# EAGLE design ARE_adaptadora_Propeller_40pin (EAGLE 6.5.0)
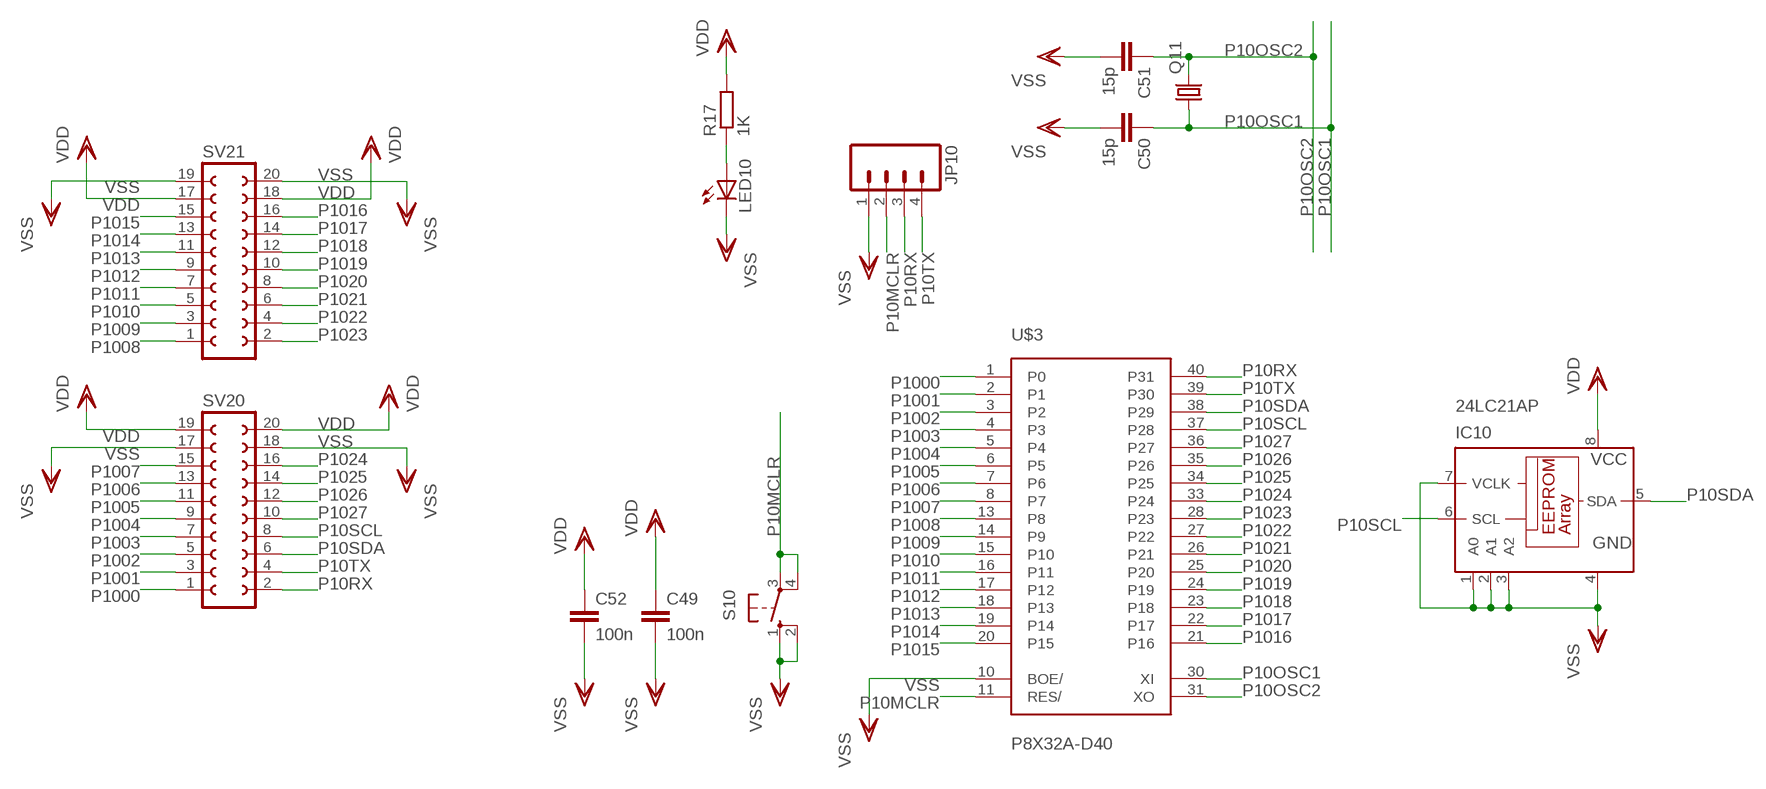
[diagram p0: schematic, sheet 1]

## Parts
C49  100n  C-EUC0805  [C0805]
C50  15p  C-EUC0805  [C0805]
C51  15p  C-EUC0805  [C0805]
C52  100n  C-EUC0805  [C0805]
IC10  24LC21AP  [DIL8]
JP10  M04PTH  [1X04]
LED10  LED3MM  [LED3MM]
Q11  CRYSTALHC18U-V  [HC18U-V]
R17  1K  R-EU_R0805  [R0805]
S10  10-XX  [B3F-10XX]
SV20  FE10-2W  [FE10-2W]
SV21  FE10-2W  [FE10-2W]
U$3  P8X32A-D40  [P8X32A-D40]

## Nets
N$13: LED10.A R17.1
P10MCLR: JP10.2 S10.3(P) S10.4(P1) U$3.11(RES/)
P10OSC1: C50.1 Q11.1 U$3.30(XI)
P10OSC2: C51.1 Q11.2 U$3.31(XO)
P10RX: JP10.3 SV20.2 U$3.40(P31)
P10SCL: IC10.6(SCL) SV20.8 U$3.37(P28)
P10SDA: IC10.5(SDA) SV20.6 U$3.38(P29)
P10TX: JP10.4 SV20.4 U$3.39(P30)
P1000: SV20.1 U$3.1(P0)
P1001: SV20.3 U$3.2(P1)
P1002: SV20.5 U$3.3(P2)
P1003: SV20.7 U$3.4(P3)
P1004: SV20.9 U$3.5(P4)
P1005: SV20.11 U$3.6(P5)
P1006: SV20.13 U$3.7(P6)
P1007: SV20.15 U$3.8(P7)
P1008: SV21.1 U$3.13(P8)
P1009: SV21.3 U$3.14(P9)
P1010: SV21.5 U$3.15(P10)
P1011: SV21.7 U$3.16(P11)
P1012: SV21.9 U$3.17(P12)
P1013: SV21.11 U$3.18(P13)
P1014: SV21.13 U$3.19(P14)
P1015: SV21.15 U$3.20(P15)
P1016: SV21.16 U$3.21(P16)
P1017: SV21.14 U$3.22(P17)
P1018: SV21.12 U$3.23(P18)
P1019: SV21.10 U$3.24(P19)
P1020: SV21.8 U$3.25(P20)
P1021: SV21.6 U$3.26(P21)
P1022: SV21.4 U$3.27(P22)
P1023: SV21.2 U$3.28(P23)
P1024: SV20.16 U$3.33(P24)
P1025: SV20.14 U$3.34(P25)
P1026: SV20.12 U$3.35(P26)
P1027: SV20.10 U$3.36(P27)
VDD: C49.1 C52.1 IC10.8(VCC) R17.2 SV20.19 SV20.20 SV21.17 SV21.18
VSS: C49.2 C50.2 C51.2 C52.2 IC10.1(A0) IC10.2(A1) IC10.3(A2) IC10.4(GND) IC10.7(VCLK) JP10.1 LED10.K(C) S10.1(S) S10.2(S1) SV20.17 SV20.18 SV21.19 SV21.20 U$3.10(BOE/)

## Power pins joined to a net without a drawn wire
VDD: U$3.12(VDD) U$3.32(VDD)
VSS: U$3.9(VSS) U$3.29(VSS)

## Library data of the parts
C49-C52 = rcl:C-EU: CAPACITOR, European symbol
IC10 = microchip_nuevo:24L*: Serial EEPROM 128 byte/1 K
JP10 = SparkFun:M04: Header 4 Standard 4-pin 0.1" header. Use with straight break away headers (SKU : PRT-00116), right angle break away headers (PRT-00553), swiss pins (PRT-00743), machine pins (PRT-00117), and female headers (PRT-00115). Molex polarized connector foot print use with SKU : PRT-08231 with associated crimp pins and housings. 1MM SMD Version SKU: PRT-10208
LED10 = SparkFun:LED: LEDs Standard schematic elements and footprints for 5mm, 3mm, 1206, and 0603 sized LEDs. 5mm - Spark Fun Electronics SKU : COM-00529 (and others)
Q11 = crystal:CRYSTAL: CRYSTAL; OC_FARNELL: unknown; OC_NEWARK: unknown
R17 = rcl:R-EU_: RESISTOR, European symbol
S10 = switch-omron:10-XX: OMRON SWITCH; MPN: B3F-1000; OC_FARNELL: 176432; OC_NEWARK: 36M3542
SV20 SV21 = con-lsta:FE10-2W: FEMALE HEADER; OC_FARNELL: unknown; OC_NEWARK: unknown
U$3 = parallax_propeller:P8X32A-D40

## Board
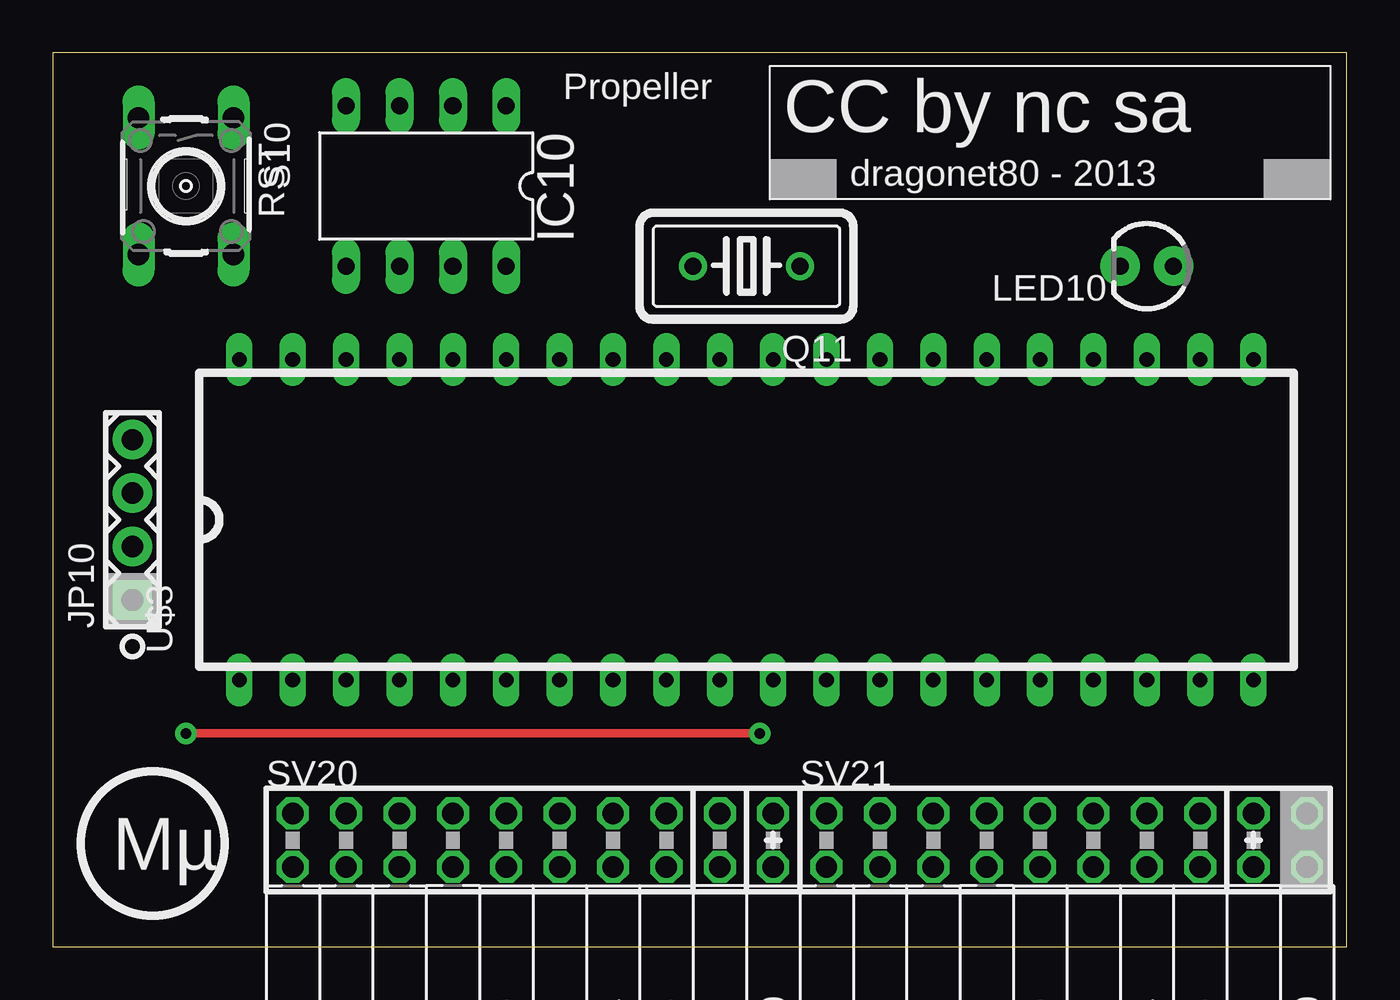
[diagram p1: board, top side]
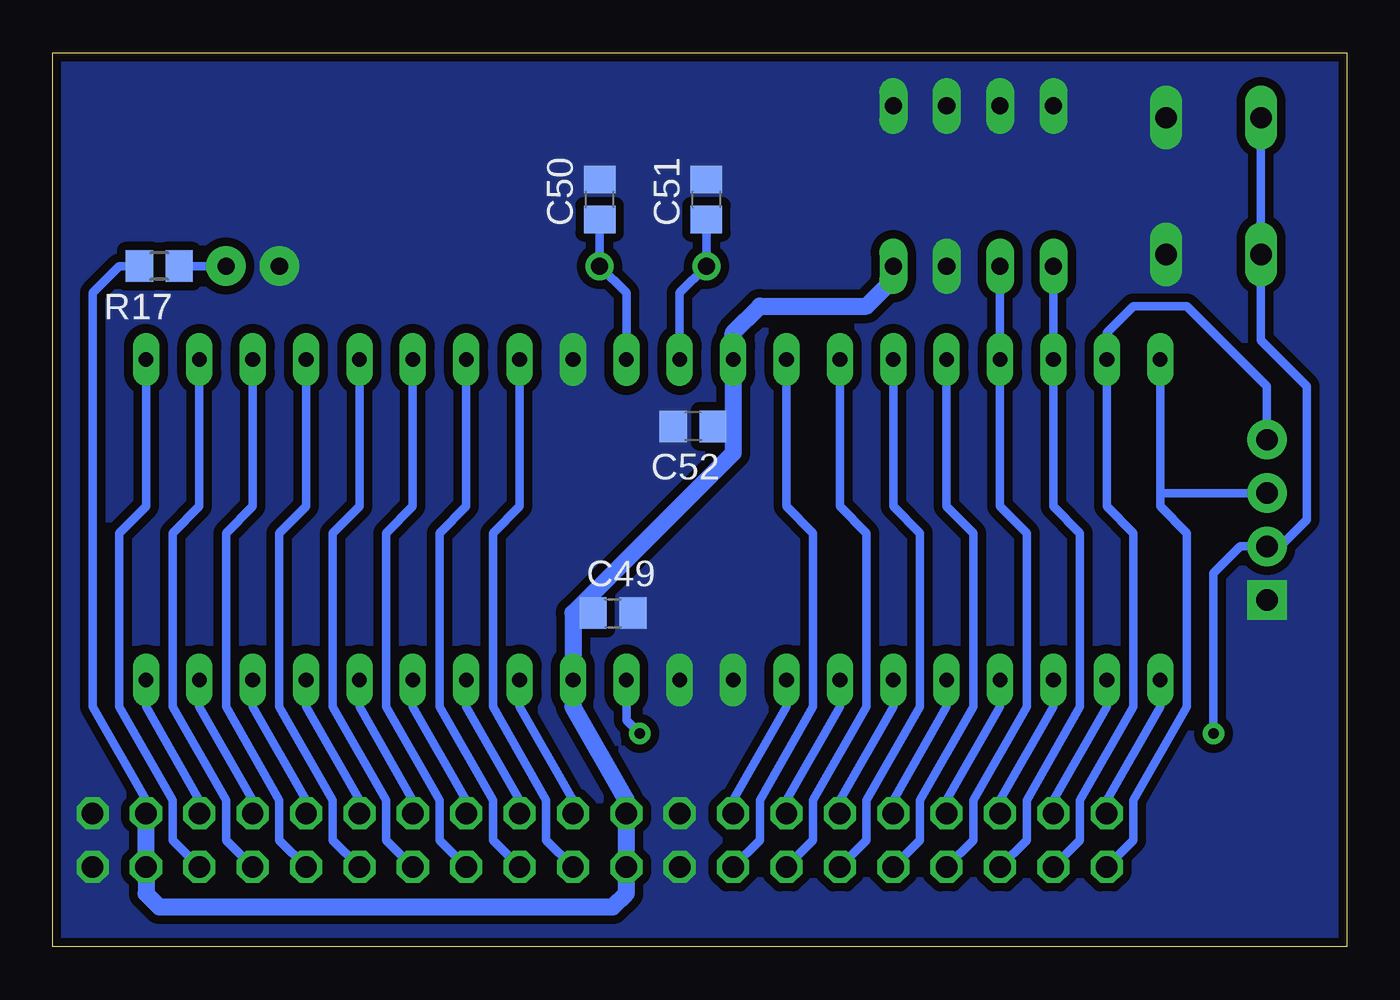
[diagram p2: board, bottom side, seen from below]

Size 61.59 x 42.55 mm. Coordinates in mm from the lower left corner, seen from the top.
Outline: 0,0 61.6,0 61.6,42.55 0,42.55 0,0
Copper layers (1*16): Top 0.035mm / dielectric 1.5mm / Bottom 0.035mm
Design rules "ITEADstudio_DRC": minimum track width 6mil, minimum drill 12mil, track to track 6mil, track to pad 6mil, pad to pad 6mil, via to via 6mil, smd to smd 0mil, copper to edge 10mil, drill to drill 10mil, minimum pad ring 10mil, minimum via ring 6mil, stop-mask expansion 2mil, vias tented up to drill 100mil, thermal gap 10mil

### Footprints (pad centres in the part's own frame; a part is rotated, then mirrored left to right if it is on the bottom)
C0805 = smd 1.3 x 1.5: 1 -0.95,0; 2 0.95,0
DIL8 = drill 0.813 long: 1 -3.81,-3.81; 2 -1.27,-3.81; 3 1.27,-3.81; 4 3.81,-3.81; 5 3.81,3.81; 6 1.27,3.81; 7 -1.27,3.81; 8 -3.81,3.81
1X04 = drill 1.016 pad 1.88 square: 1 0,0 | drill 1.016 pad 1.88: 2 2.54,0; 3 5.08,0; 4 7.62,0
LED3MM = drill 0.813 pad 1.88: A -1.27,0; K 1.27,0
HC18U-V = drill 0.813: 1 -2.54,0; 2 2.54,0
R0805 = smd 1.3 x 1.5: 1 -0.95,0; 2 0.95,0
B3F-10XX = drill 1.016 long: 1 -3.251,2.261; 2 3.251,2.261; 3 -3.251,-2.261; 4 3.251,-2.261
FE10-2W = drill 1.016 octagon: 1 -11.43,1.27; 2 -11.43,-1.27; 3 -8.89,1.27; 4 -8.89,-1.27; 5 -6.35,1.27; 6 -6.35,-1.27; 7 -3.81,1.27; 8 -3.81,-1.27; 9 -1.27,1.27; 10 -1.27,-1.27; 11 1.27,1.27; 12 1.27,-1.27; 13 3.81,1.27; 14 3.81,-1.27; 15 6.35,1.27; 16 6.35,-1.27; 17 8.89,1.27; 18 8.89,-1.27; 19 11.43,1.27; 20 11.43,-1.27
P8X32A-D40 = drill 0.7 pad 1.27 long: 1 -7.62,23.495; 2 -7.62,20.955; 3 -7.62,18.415; 4 -7.62,15.875; 5 -7.62,13.335; 6 -7.62,10.795; 7 -7.62,8.255; 8 -7.62,5.715; 9 -7.62,3.175; 10 -7.62,0.635; 11 -7.62,-1.905; 12 -7.62,-4.445; 13 -7.62,-6.985; 14 -7.62,-9.525; 15 -7.62,-12.065; 16 -7.62,-14.605; 17 -7.62,-17.145; 18 -7.62,-19.685; 19 -7.62,-22.225; 20 -7.62,-24.765; 21 7.62,-24.765; 22 7.62,-22.225; 23 7.62,-19.685; 24 7.62,-17.145; 25 7.62,-14.605; 26 7.62,-12.065; 27 7.62,-9.525; 28 7.62,-6.985; 29 7.62,-4.445; 30 7.62,-1.905; 31 7.62,0.635; 32 7.62,3.175; 33 7.62,5.715; 34 7.62,8.255; 35 7.62,10.795; 36 7.62,13.335; 37 7.62,15.875; 38 7.62,18.415; 39 7.62,20.955; 40 7.62,23.495

### Placement (x,y rotation side)
C49  34.92,15.88 0 bottom
C50  35.56,35.56 90 bottom
C51  30.48,35.56 90 bottom
C52  31.12,24.77 180 bottom
IC10  17.78,36.2 180 top
JP10  3.81,16.51 90 top
LED10  52.07,32.39 180 top
Q11  33.02,32.39 180 top
R17  56.52,32.39 180 bottom
S10  6.35,36.2 270 top
SV20  22.86,5.08 0 top
SV21  48.26,5.08 0 top
U$3  32.38,20.32 90 top

### Tracks (layer width: path | path; a pad name or v marks a point on that pad's centre or on a via)
N$13
  Bottom 0.406: R17.1 LED10.A
P10MCLR  (via drill 0.5 pad 1.02)
  Top 0.406: v33.66,10.16 v6.35,10.16
  Bottom 0.406: S10.3 S10.4 4.09,28.85 1.91,26.67 1.91,20.32 3.18,19.05 JP10.2 5.08,19.05 6.35,17.78 v6.35,10.16 | U$3.11 34.29,10.8 v33.66,10.16
P10OSC1
  Bottom 0.406: U$3.30 34.29,31.12 Q11.1 C50.1
P10OSC2
  Bottom 0.406: U$3.31 31.75,31.12 Q11.2 C51.1
P10RX
  Bottom 0.406: U$3.40 8.89,21.59 | 8.89,21.59 8.89,20.96 7.62,19.69 7.62,11.43 10.16,6.98 10.16,5.08 SV20.2 | JP10.3 8.89,21.59
P10SCL
  Bottom 0.406: SV20.8 17.78,5.08 17.78,6.98 15.24,11.43 15.24,19.69 16.51,20.96 U$3.37 IC10.6
P10SDA
  Bottom 0.406: SV20.6 15.24,5.08 15.24,6.98 12.7,11.43 12.7,19.69 13.97,20.96 U$3.38 IC10.5
P10TX
  Bottom 0.406: SV20.4 12.7,5.08 12.7,6.98 10.16,11.43 10.16,19.69 11.43,20.96 U$3.39 11.43,29.21 10.16,30.48 7.62,30.48 3.81,26.67 JP10.4
P1000
  Bottom 0.406: U$3.1 8.89,11.43 11.43,6.98 SV20.1
P1001
  Bottom 0.406: U$3.2 11.43,11.43 13.97,6.98 SV20.3
P1002
  Bottom 0.406: U$3.3 13.97,11.43 16.51,6.98 SV20.5
P1003
  Bottom 0.406: U$3.4 16.51,11.43 19.05,6.98 SV20.7
P1004
  Bottom 0.406: U$3.5 19.05,11.43 21.59,6.98 SV20.9
P1005
  Bottom 0.406: U$3.6 21.59,11.43 24.13,6.98 SV20.11
P1006
  Bottom 0.406: U$3.7 24.13,11.43 26.67,6.98 SV20.13
P1007
  Bottom 0.406: U$3.8 26.67,11.43 29.21,6.98 SV20.15
P1008
  Bottom 0.406: SV21.1 36.83,6.98 39.37,11.43 U$3.13
P1009
  Bottom 0.406: U$3.14 41.91,11.43 39.37,6.98 SV21.3
P1010
  Bottom 0.406: U$3.15 44.45,11.43 41.91,6.98 SV21.5
P1011
  Bottom 0.406: U$3.16 46.99,11.43 44.45,6.98 SV21.7
P1012
  Bottom 0.406: U$3.17 49.53,11.43 46.99,6.98 SV21.9
P1013
  Bottom 0.406: U$3.18 52.07,11.43 49.53,6.98 SV21.11
P1014
  Bottom 0.406: U$3.19 54.61,11.43 52.07,6.98 SV21.13
P1015
  Bottom 0.406: U$3.20 57.15,11.43 54.61,6.98 SV21.15
P1016
  Bottom 0.406: U$3.21 57.15,20.96 58.42,19.69 58.42,11.43 55.88,6.98 55.88,5.08 SV21.16
P1017
  Bottom 0.406: U$3.22 54.61,20.96 55.88,19.69 55.88,11.43 53.34,6.98 53.34,5.08 SV21.14
P1018
  Bottom 0.406: U$3.23 52.07,20.96 53.34,19.69 53.34,11.43 50.8,6.98 50.8,5.08 SV21.12
P1019
  Bottom 0.406: U$3.24 49.53,20.96 50.8,19.69 50.8,11.43 48.26,6.98 48.26,5.08 SV21.10
P1020
  Bottom 0.406: U$3.25 46.99,20.96 48.26,19.69 48.26,11.43 45.72,6.98 45.72,5.08 SV21.8
P1021
  Bottom 0.406: U$3.26 44.45,20.96 45.72,19.69 45.72,11.43 43.18,6.98 43.18,5.08 SV21.6
P1022
  Bottom 0.406: U$3.27 41.91,20.96 43.18,19.69 43.18,11.43 40.64,6.98 40.64,5.08 SV21.4
P1023
  Bottom 0.406: U$3.28 39.37,20.96 40.64,19.69 40.64,11.43 38.1,6.98 38.1,5.08 SV21.2
P1024
  Bottom 0.406: U$3.33 26.67,20.96 25.4,19.69 25.4,11.43 27.94,6.98 27.94,5.08 SV20.16
P1025
  Bottom 0.406: U$3.34 24.13,20.96 22.86,19.69 22.86,11.43 25.4,6.98 25.4,5.08 SV20.14
P1026
  Bottom 0.406: U$3.35 21.59,20.96 20.32,19.69 20.32,11.43 22.86,6.98 22.86,5.08 SV20.12
P1027
  Bottom 0.406: U$3.36 19.05,20.96 17.78,19.69 17.78,11.43 20.32,6.98 20.32,5.08 SV20.10
VDD
  Bottom 0.406: SV21.17 57.15,6.98 59.69,11.43 59.69,31.12 58.42,32.39 R17.2 | C49.1 36.83,15.88 | C52.1 29.21,24.77
  Bottom 0.813: IC10.8 21.59,31.75 22.86,30.48 27.94,30.48 29.21,29.21 U$3.32 29.21,24.77 29.21,23.5 36.83,15.88 U$3.12 36.83,11.43 34.29,6.98 SV20.19 SV20.20 34.29,2.54 34.92,1.91 56.52,1.91 57.15,2.54 SV21.18 SV21.17
VSS
  pour Bottom (isolate 0.406, no thermals): 0,0 61.59,0 61.59,42.55 0,42.55

### Text on the board
_tsilk: Propeller | RST | CC by nc sa | dragonet80 - 2013 | Mµ